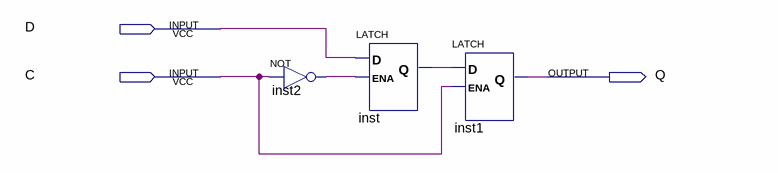
[diagram p0: schematic sheet]
// Quartus schematic ff.bdf as structural Verilog: 3 symbols, 3 pins
module ff (
  input  D,
  input  C,
  output Q
);

  wire inst2_out, inst_q;

  not inst2 (inst2_out, C);
  LATCH inst (.D(D), .ENA(inst2_out), .Q(inst_q));
  LATCH inst1 (.D(inst_q), .ENA(C), .Q(Q));
endmodule
